# Altium schematic sheet HFXO.SchDoc: Chronos
size A4; CompanyName: RF Ranging Inc.; Engineer: Thomas Schmid; Revision: 4; SheetNumber: 7; SheetTotal: 10
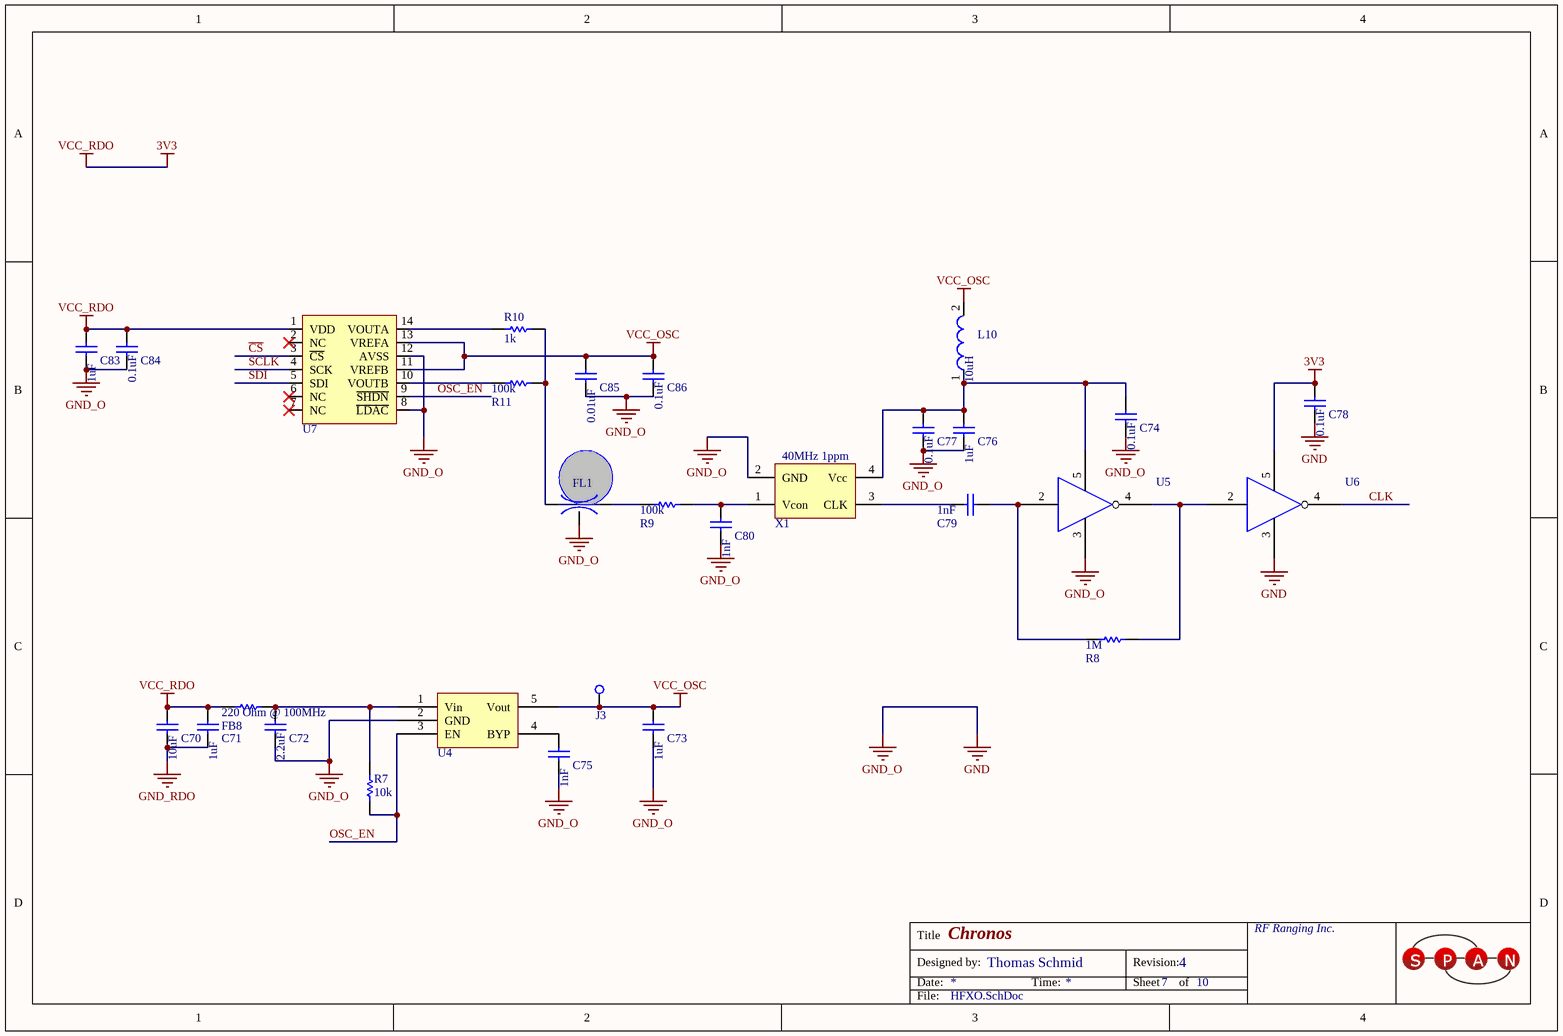
[diagram p0: HFXO.SchDoc]

## Parts
C70  GRM188C81C106MA73D  [CAPC1608X08N (0603)]  (value not drawn)
C71  GRM188R61A105KA61D  [CAPC1608X08N (0603)]  (value not drawn)
C72  GRM188R60J225KE19D  [CAPC1608X08N (0603)]  (value not drawn)
C73  GRM188R61A105KA61D  [CAPC1608X08N (0603)]  (value not drawn)
C74  GRM188R71C104KA01D  [CAPC1608X08N (0603)]  (value not drawn)
C75  GRM1885C1H102JA01D  [CAPC1608X08N (0603)]  (value not drawn)
C76  GRM188R61A105KA61D  [CAPC1608X08N (0603)]  (value not drawn)
C77  GRM188R71C104KA01D  [CAPC1608X08N (0603)]  (value not drawn)
C78  GRM188R71C104KA01D  [CAPC1608X08N (0603)]  (value not drawn)
C79  GRM1885C1H102JA01D  [CAPC1608X08N (0603)]  (value not drawn)
C80  GRM1885C1H102JA01D  [CAPC1608X08N (0603)]  (value not drawn)
C83  GRM188R61A105KA61D  [CAPC1608X08N (0603)]  (value not drawn)
C84  GRM188R71C104KA01D  [CAPC1608X08N (0603)]  (value not drawn)
C85  GRM188R71C103KA01D  [CAPC1608X08N (0603)]  (value not drawn)
C86  GRM188R71C104KA01D  [CAPC1608X08N (0603)]  (value not drawn)
FB8  BLM18BD221SN1D  [RESC1608X06N (0603)]  (value not drawn)
FL1  NFM21CC223R1H3D  [NFM21C]  (value not drawn)
J3  5004  [TP]  (value not drawn)
L10  LQM18FN100M00D  [INDC1608X08N]  (value not drawn)
R7  value 10k  [RESC1608X06N (0603)]  (hidden comment: MCR03ERTF1002)
R8  RC0603FR-071ML  [RESC1608X06N (0603)]  (value not drawn)
R9  RC0603FR-07100KL  [RESC1608X06N (0603)]  (value not drawn)
R10  value 1k  (hidden comment: CRCW06031K00FKEA)
R11  RC0603FR-07100KL  [RESC1608X06N (0603)]  (value not drawn)
U4  FAN2500S30X  [SOT95P280X145-5N]  (value not drawn)
U5  NC7SPU04P5X  [SC70]  (value not drawn)
U6  NC7SPU04P5X  [SC70]  (value not drawn)
U7  MCP4922-E/ST  [TSOP65P640X110-14N]  (value not drawn)
X1  ASVTX-12-A-40.000MHZ-H10-T  [2.5x2.0x0.9mmXTAL]  (value not drawn)

## Nets
3V3: C70.2 C71.2 C78.2 C83.2 C84.2 FB8.1 U6.5 U7.1(VDD)  [also labelled VCC_RDO]
GND: C72.1 C73.1 C74.1 C75.1 C76.1 C77.1 C78.1 C80.1 C83.1 C84.1 C85.1 C86.1 FL1.2 U4.2(GND) U5.3 U6.3 U7.8(~{LDAC}) U7.12(AVSS) X1.2(GND)  [also labelled GND_O]
GND_RDO: C70.1 C71.1
VCC_OSC: C73.2 C85.2 C86.2 J3.1 L10.2 U4.5(Vout) U7.11(VREFB) U7.13(VREFA)
~{CS}: U7.3(~{CS})
CLK: U6.4
OSC_EN: R7.1 U4.3(EN) U7.9(~{SHDN})
SCLK: U7.4(SCK)
SDI: U7.5(SDI)
NetC72_2: C72.2 FB8.2 R7.2 U4.1(Vin)
NetC74_2: C74.2 C76.2 C77.2 L10.1 U5.5 X1.4(Vcc)
NetC75_2: C75.2 U4.4(BYP)
NetC79_1: C79.1 X1.3(CLK)
NetC79_2: C79.2 R8.1 U5.2
NetC80_2: C80.2 R9.2 X1.1(Vcon)
NetFL1_1: FL1.1 R10.2 R11.2
NetFL1_3: FL1.3 R9.1
NetR8_2: R8.2 U5.4 U6.2
NetR10_1: R10.1 U7.14(VOUTA)
NetR11_1: R11.1 U7.10(VOUTB)

Not connected (* = marked no-connect by the designer): U5 1; U6 1; U7 2(NC)* 6(NC)* 7(NC)*

## Notes on the sheet
- Title
- Designed by:
- Date:
- Time:
- Revision:
- Sheet
- of
- File:
- (in symbol ASVTX-12-A-40.000MHZ-H10-T) 40MHz 1ppm
- (in symbol GRM188C81C106MA73D) 10uF
- (in symbol GRM188R60J225KE19D) 2.2uF
- (in symbol GRM188R61A105KA61D) 1uF
- (in symbol GRM188R71C103KA01D) 0.01uF
- (in symbol GRM188R71C104KA01D) 0.1uF
- (in symbol GRM1885C1H102JA01D) 1nF
- (in symbol LQM18FN100M00D) 10uH

## Library data of the parts
C70 = GRM188C81C106MA73D: CAP CER 10UF 16V 20% X6S 0603; Manufacturer: Murata Electronics North America; Capacitance: 10µF; Supplier 1: Digi-Key; Manufacturer Part Number: GRM188C81C106MA73D; RoHS: RoHS Compliant; Category: Capacitors; Stock 1: 59274; Pricing 1: 1=0.4, 10=0.349, 50=0.2118, 100=0.1744, 250=0.13952, 500=0.12708, 1000=0.11237 (USD); Packaging: Cut Tape (CT); Voltage - Rated: 16V; Tolerance: ±20%; Temperature Coefficient: X6S; Mounting Type: Surface Mount, MLCC; Operating Temperature: -55°C ~ 105°C; Applications: General Purpose; Ratings: -; Package / Case: 0603 (1608 Metric); Size / Dimension: 0.063" L x 0.031" W (1.60mm x 0.80mm); Height - Seated (Max): -; Thickness (Max): 0.031" (0.80mm); Lead Spacing: -; Features: -; Lead Style: -; ComponentLink1URL: http://www.murata.com/products/catalog/pdf/c02e.pdf; ComponentLink1Description: http://www.murata.com/products/catalog/pdf/c02e.pdf
C71 C73 C76 C83 = GRM188R61A105KA61D: CAP CER 1UF 10V 10% X5R 0603; Manufacturer: Murata Electronics North America; Capacitance: 1.0µF; Supplier 1: Digi-Key; Manufacturer Part Number: GRM188R61A105KA61D; RoHS: RoHS Compliant; Category: Capacitors; Stock 1: 244919; Pricing 1: 1=0.1, 10=0.041, 50=0.0224, 100=0.019, 250=0.01552, 500=0.01328, 1000=0.01035 (USD); Packaging: Cut Tape (CT); Voltage - Rated: 10V; Tolerance: ±10%; Temperature Coefficient: X5R; Mounting Type: Surface Mount, MLCC; Operating Temperature: -55°C ~ 85°C; Applications: General Purpose; Ratings: -; Package / Case: 0603 (1608 Metric); Size / Dimension: 0.063" L x 0.031" W (1.60mm x 0.80mm); Height - Seated (Max): -; Thickness (Max): 0.035" (0.90mm); Lead Spacing: -; Features: -; Lead Style: -; ComponentLink1URL: http://search.murata.co.jp/Ceramy/image/img/A01X/G101/ENG/GRM188R61A105KA61-01.pdf; ComponentLink1Description: http://search.murata.co.jp/Ceramy/image/img/A01X/G101/ENG/GRM188R61A105KA61-01.pdf
C72 = GRM188R60J225KE19D: CAP CER 2.2UF 6.3V 10% X5R 0603; Manufacturer: Murata Electronics North America; Capacitance: 2.2µF; Supplier 1: Digi-Key; Manufacturer Part Number: GRM188R60J225KE19D; RoHS: RoHS Compliant; Category: Capacitors; Stock 1: 155330; Pricing 1: 1=0.17, 10=0.114, 50=0.0658, 100=0.0543, 250=0.04572, 500=0.0383, 1000=0.03143 (USD); Packaging: Cut Tape (CT); Voltage - Rated: 6.3V; Tolerance: ±10%; Temperature Coefficient: X5R; Mounting Type: Surface Mount, MLCC; Operating Temperature: -55°C ~ 85°C; Applications: General Purpose; Ratings: -; Package / Case: 0603 (1608 Metric); Size / Dimension: 0.063" L x 0.031" W (1.60mm x 0.80mm); Height - Seated (Max): -; Thickness (Max): 0.035" (0.90mm); Lead Spacing: -; Features: -; Lead Style: -; ComponentLink1URL: http://search.murata.co.jp/Ceramy/image/img/A01X/G101/ENG/GRM188R60J225KE19-01.pdf; ComponentLink1Description: http://search.murata.co.jp/Ceramy/image/img/A01X/G101/ENG/GRM188R60J225KE19-01.pdf
C74 C77 C78 C84 C86 = GRM188R71C104KA01D: CAP CER 0.1UF 16V 10% X7R 0603; Manufacturer: Murata Electronics North America; Capacitance: 0.1µF; Supplier 1: Digi-Key; Manufacturer Part Number: GRM188R71C104KA01D; RoHS: RoHS Compliant; Category: Capacitors; Stock 1: 1458181; Pricing 1: 1=0.1, 10=0.019, 50=0.0102, 100=0.0086, 250=0.00704, 500=0.006, 1000=0.00468 (USD); Packaging: Cut Tape (CT); Tolerance: ±10%; Voltage - Rated: 16V; Temperature Coefficient: X7R; Mounting Type: Surface Mount, MLCC; Operating Temperature: -55°C ~ 125°C; Applications: General Purpose; Ratings: -; Package / Case: 0603 (1608 Metric); Size / Dimension: 0.063" L x 0.031" W (1.60mm x 0.80mm); Height - Seated (Max): -; Thickness (Max): 0.035" (0.90mm); Lead Spacing: -; Features: -; Lead Style: -; ComponentLink1URL: http://search.murata.co.jp/Ceramy/image/img/A01X/G101/ENG/GRM188R71C104KA01-01.pdf; ComponentLink1Description: http://search.murata.co.jp/Ceramy/image/img/A01X/G101/ENG/GRM188R71C104KA01-01.pdf
C75 C79 C80 = GRM1885C1H102JA01D: CAP CER 1000PF 50V 5% NP0 0603; Manufacturer: Murata Electronics North America; Temperature Coefficient: C0G, NP0; Supplier 1: Digi-Key; Manufacturer Part Number: GRM1885C1H102JA01D; RoHS: RoHS Compliant; Category: Capacitors; Stock 1: 140000; Pricing 1: 4000=0.00863, 8000=0.00788, 12000=0.0075, 28000=0.00713, 100000=0.00516 (USD); Packaging: Tape & Reel (TR); Capacitance: 1000pF; Voltage - Rated: 50V; Tolerance: ±5%; Mounting Type: Surface Mount, MLCC; Operating Temperature: -55°C ~ 125°C; Applications: General Purpose; Ratings: -; Package / Case: 0603 (1608 Metric); Size / Dimension: 0.063" L x 0.031" W (1.60mm x 0.80mm); Height - Seated (Max): -; Thickness (Max): 0.035" (0.90mm); Lead Spacing: -; Features: -; Lead Style: -; ComponentLink1URL: http://www.murata.com/products/catalog/pdf/c02e.pdf; ComponentLink1Description: http://www.murata.com/products/catalog/pdf/c02e.pdf
C85 = GRM188R71C103KA01D: CAP CER 10000PF 16V 10% X7R 0603; Manufacturer: Murata Electronics North America; Supplier 1: Digi-Key; Manufacturer Part Number: GRM188R71C103KA01D; RoHS: RoHS Compliant; Category: Capacitors; Stock 1: 0; Pricing 1: 1=0 (USD); Packaging: Cut Tape (CT); Capacitance: 10000pF; Voltage - Rated: 16V; Tolerance: ±10%; Temperature Coefficient: X7R; Mounting Type: Surface Mount, MLCC; Operating Temperature: -55°C ~ 125°C; Applications: General Purpose; Ratings: -; Package / Case: 0603 (1608 Metric); Size / Dimension: 0.063" L x 0.031" W (1.60mm x 0.80mm); Height - Seated (Max): -; Thickness (Max): 0.035" (0.90mm); Lead Spacing: -; Features: -; Lead Style: -; ComponentLink1URL: http://search.murata.co.jp/Ceramy/image/img/A01X/G101/ENG/GRM188R71C103KA01-01.pdf; ComponentLink1Description: http://search.murata.co.jp/Ceramy/image/img/A01X/G101/ENG/GRM188R71C103KA01-01.pdf
FB8 = BLM18BD221SN1D: FERRITE CHIP 220 OHM 200MA 0603; Manufacturer: Murata Electronics North America; Impedance @ Frequency: 220 Ohm @ 100MHz; DC Resistance (DCR): 450 mOhm Max; Filter Type: Differential Mode - Single; Supplier 1: Digi-Key; Manufacturer Part Number: BLM18BD221SN1D; RoHS: RoHS Compliant; Category: Filters; Stock 1: 35645; Pricing 1: 1=0.1, 10=0.087, 50=0.0712, 100=0.0523, 250=0.038, 500=0.03484, 1000=0.0301 (USD); Packaging: Cut Tape (CT); Current Rating: 200mA; Package / Case: 0603 (1608 Metric); Mounting Type: Surface Mount; Height (Max): 0.037" (0.95mm); Size / Dimension: 0.063" L x 0.031" W (1.60mm x 0.80mm); ComponentLink1URL: http://search.murata.co.jp/Ceramy/image/img/PDF/ENG/L0110S0100BLM18B.pdf; ComponentLink1Description: http://search.murata.co.jp/Ceramy/image/img/PDF/ENG/L0110S0100BLM18B.pdf
FL1 = NFM21CC223R1H3D: FILTER LC HIGH FREQ 22000PF 0805; Manufacturer: Murata Electronics North America; Capacitance: 0.022µF; Voltage: 50V; Current: 2A; DC Resistance (DCR): 30 mOhm Max; Supplier 1: Digi-Key; Manufacturer Part Number: NFM21CC223R1H3D; RoHS: RoHS Compliant; Category: Filters; Stock 1: 4000; Pricing 1: 4000=0.12353, 8000=0.11438 (USD); Packaging: Tape & Reel (TR); Operating Temperature: -55°C ~ 125°C; Package / Case: 0805 (2012 Metric), 3 PC Pad; Height (Max): 0.037" (0.95mm); Size / Dimension: 0.079" L x 0.049" W (2.00mm x 1.25mm); Thread Size: -; ComponentLink1URL: http://search.murata.co.jp/Ceramy/image/img/PDF/ENG/L0111S0109NFM21C.pdf; ComponentLink1Description: http://search.murata.co.jp/Ceramy/image/img/PDF/ENG/L0111S0109NFM21C.pdf
J3 = 5004: TEST POINT PC MINI .040"D YELLOW; Manufacturer: Keystone Electronics; Supplier 1: Digi-Key; Manufacturer Part Number: 5004; RoHS: RoHS Compliant; Category: Test and Measurement; Stock 1: 45761; Pricing 1: 1=0.34, 10=0.318, 50=0.232, 100=0.2228, 250=0.20008, 500=0.191, 1000=0.15916, 2500=0.14552, 5000=0.13643 (USD); Packaging: Bulk; Type: PC Test Point, Miniature; Terminal: 0.010" x 0.020" (0.25mm x 0.51mm) Phosphor Bronze Wire, Silver Plated; Mounting Type: 0.040" (1.02mm) Hole Diameter; Material: Base, Nylon 46, UL 94V-0; Color: Yellow; ComponentLink1URL: http://www.keyelco.com/product-pdf.cfm?p=1313; ComponentLink1Description: http://www.keyelco.com/product-pdf.cfm?p=1313
L10 = LQM18FN100M00D: INDUCTOR 10UH 50MA 0603; Manufacturer: Murata Electronics North America; Type: Multilayer; Inductance: 10µH; Tolerance: ±20%; Shielding: Shielded; DC Resistance (DCR): 900 mOhm; Frequency - Self Resonant: 30MHz; Frequency - Test: 1MHz; Supplier 1: Digi-Key; Manufacturer Part Number: LQM18FN100M00D; RoHS: RoHS Compliant; Category: Inductors, Coils, Chokes; Stock 1: 28547; Pricing 1: 1=0.14, 10=0.13, 25=0.1164, 50=0.101, 100=0.0907, 250=0.08416, 500=0.0777, 750=0.07381, 1000=0.06734 (USD); Packaging: Cut Tape (CT); Material - Core: -; Current Rating: 50mA; Current - Saturation: -; Q @ Freq: -; Operating Temperature: -55°C ~ 125°C; Mounting Type: Surface Mount; Package / Case: 0603 (1608 Metric); Size / Dimension: 0.063" L x 0.031" W (1.60mm x 0.80mm); Height - Seated (Max): 0.035" (0.90mm); Supplier Device Package: 0603 (1608 Metric); ComponentLink1URL: http://search.murata.co.jp/Ceramy/image/img/PDF/ENG/L0075S0097LQM18F.pdf; ComponentLink1Description: http://search.murata.co.jp/Ceramy/image/img/PDF/ENG/L0075S0097LQM18F.pdf
R7 = MCR03ERTF1002: RES SMD 10K OHM 1% 1/10W 0603; Manufacturer: Rohm Semiconductor; Power (Watts): 0.1W, 1/10W; Temperature Coefficient: ±100ppm/°C; Supplier 1: Digi-Key; Manufacturer Part Number: MCR03ERTF1002; RoHS: RoHS Compliant; Category: Resistors; Stock 1: 30590; Pricing 1: 1=0.1, 10=0.022, 25=0.016, 100=0.0089, 250=0.0068, 500=0.00542, 1000=0.00399 (USD); Packaging: Digi-Reel®; Resistance (Ohms): 10k; Tolerance: ±1%; Composition: Thick Film; Features: -; Package / Case: 0603 (1608 Metric); Supplier Device Package: 0603 (1608 Metric); Size / Dimension: 0.063" L x 0.031" W (1.60mm x 0.80mm); Height: 0.022" (0.55mm); Number of Terminations: 2; ComponentLink1URL: http://rohmfs.rohm.com/en/products/databook/datasheet/passive/resistor/chip_resistor/mcr_g.pdf; ComponentLink1Description: http://rohmfs.rohm.com/en/products/databook/datasheet/passive/resistor/chip_resistor/mcr_g.pdf; Operating Temperature: -55°C ~ 155°C; Supplier Part Number 1: RHM10.0KCFDKR-ND
R8 = RC0603FR-071ML: RES 1.00M OHM 1/10W 1% 0603 SMD; Manufacturer: Yageo; Resistance (Ohms): 1M; Power (Watts): 0.1W, 1/10W; Temperature Coefficient: ±100ppm/°C; Supplier 1: Digi-Key; Manufacturer Part Number: RC0603FR-071ML; RoHS: RoHS Compliant; Category: Resistors; Stock 1: 1280000; Pricing 1: 5000=0.00171, 10000=0.00149, 25000=0.00131, 50000=0.0012, 125000=0.00117 (USD); Packaging: Tape & Reel (TR); Tolerance: ±1%; Composition: Thick Film; Features: -; Package / Case: 0603 (1608 Metric); Supplier Device Package: 0603; Size / Dimension: 0.063" L x 0.031" W (1.60mm x 0.80mm); Height: 0.022" (0.55mm); Number of Terminations: 2; ComponentLink1URL: http://www.yageo.com/documents/recent/PYu-RC0603_51_RoHS_L_4.pdf; ComponentLink1Description: http://www.yageo.com/documents/recent/PYu-RC0603_51_RoHS_L_4.pdf
R9 R11 = RC0603FR-07100KL: RES 100K OHM 1/10W 1% 0603 SMD; Manufacturer: Yageo; Power (Watts): 0.1W, 1/10W; Temperature Coefficient: ±100ppm/°C; Supplier 1: Digi-Key; Manufacturer Part Number: RC0603FR-07100KL; RoHS: RoHS Compliant; Category: Resistors; Stock 1: 2865000; Pricing 1: 5000=0.00171, 10000=0.00149, 25000=0.00131, 50000=0.0012, 125000=0.00117 (USD); Packaging: Tape & Reel (TR); Resistance (Ohms): 100k; Tolerance: ±1%; Composition: Thick Film; Features: -; Package / Case: 0603 (1608 Metric); Supplier Device Package: 0603; Size / Dimension: 0.063" L x 0.031" W (1.60mm x 0.80mm); Height: 0.022" (0.55mm); Number of Terminations: 2; ComponentLink1URL: http://www.yageo.com/documents/recent/PYu-RC0603_51_RoHS_L_4.pdf; ComponentLink1Description: http://www.yageo.com/documents/recent/PYu-RC0603_51_RoHS_L_4.pdf
R10 = CRCW06031K00FKEA: RES SMD 1K OHM 1% 1/10W 0603; Manufacturer: Vishay Dale; Power (Watts): 0.1W, 1/10W; Temperature Coefficient: ±100ppm/°C; Supplier 1: Digi-Key; Manufacturer Part Number: CRCW06031K00FKEA; RoHS: RoHS Compliant; Category: Resistors; Stock 1: 1035099; Pricing 1: 10=0.081, 50=0.0436, 200=0.0251, 1000=0.01711 (USD); Packaging: Digi-Reel®; Resistance (Ohms): 1k; Tolerance: ±1%; Composition: Thick Film; Features: Automotive AEC-Q200; Package / Case: 0603 (1608 Metric); Supplier Device Package: 0603 (1608 Metric); Size / Dimension: 0.061" L x 0.033" W (1.55mm x 0.85mm); Height: 0.020" (0.50mm); Number of Terminations: 2; ComponentLink1URL: http://www.vishay.com/docs/20035/dcrcwe3.pdf; ComponentLink1Description: http://www.vishay.com/docs/20035/dcrcwe3.pdf; Operating Temperature: -55°C ~ 155°C; Supplier Part Number 1: 541-1.00KHDKR-ND
U4 = FAN2500S30X: IC REG LDO 3V 0.1A SOT23-5; Manufacturer: Fairchild Semiconductor; Regulator Topology: Positive Fixed; Current - Output: 100mA; Voltage - Dropout (Typical): 0.1V @ 100mA; Number of Regulators: 1; Voltage - Input: Up to 6.5V; Supplier 1: Digi-Key; Manufacturer Part Number: FAN2500S30X; RoHS: RoHS Compliant; Category: Integrated Circuits (ICs); Stock 1: 6000; Pricing 1: 3000=0.25462, 6000=0.23706, 15000=0.22828, 30000=0.2195, 75000=0.21599, 150000=0.21072 (USD); Packaging: Tape & Reel (TR); Voltage - Output: 3V; Current - Limit (Min): -; Operating Temperature: -40°C ~ 125°C; Mounting Type: Surface Mount; Package / Case: SC-74A, SOT-753; Supplier Device Package: SOT-23-5; ComponentLink1URL: http://www.fairchildsemi.com/ds/FA/FAN2500.pdf; ComponentLink1Description: http://www.fairchildsemi.com/ds/FA/FAN2500.pdf
U5 U6 = NC7SPU04P5X: IC INVERTER ULP UNBUFF SC70-5; Manufacturer: Fairchild Semiconductor; Number of Circuits: 1; Voltage - Supply: 0.9 V ~ 3.6 V; Current - Quiescent (Max): 0.9µA; Current - Output High, Low: 2.6mA, 2.6mA; Max Propagation Delay @ V, Max CL: 9.2ns @ 3.3V, 30pF; Supplier 1: Digi-Key; Manufacturer Part Number: NC7SPU04P5X; RoHS: RoHS Compliant; Category: Integrated Circuits (ICs); Stock 1: 24000; Pricing 1: 3000=0.0798, 6000=0.07182, 15000=0.06384, 30000=0.05985, 75000=0.05307, 150000=0.05107 (USD); Packaging: Tape & Reel (TR); Logic Type: Inverter; Number of Inputs: 1; Features: -; Logic Level - Low: -; Logic Level - High: -; Operating Temperature: -40°C ~ 85°C; Mounting Type: Surface Mount; Supplier Device Package: SC-70-5; Package / Case: 6-TSSOP (5 Lead), SC-88A, SOT-353; ComponentLink1URL: http://www.fairchildsemi.com/ds/NC/NC7SPU04.pdf; ComponentLink1Description: http://www.fairchildsemi.com/ds/NC/NC7SPU04.pdf
U7 = MCP4922-E/ST: IC DAC 12BIT DUAL W/SPI 14TSSOP; Manufacturer: Microchip Technology; Settling Time: 4.5µs; Number of Bits: 12; Data Interface: Serial, SPI™; Number of Converters: 2; Voltage Supply Source: Single Supply; Number of Outputs and Type: 2 Voltage, Unipolar; 2 Voltage, Bipolar; Supplier 1: Digi-Key; Manufacturer Part Number: MCP4922-E/ST; RoHS: RoHS Compliant; Category: Integrated Circuits (ICs); Stock 1: 461; Pricing 1: 1=3.14, 10=2.62, 25=2.19, 100=1.99 (USD); Packaging: Tube; Operating Temperature: -40°C ~ 125°C; Mounting Type: Surface Mount; Package / Case: 14-TSSOP (0.173", 4.40mm Width); Supplier Device Package: 14-TSSOP; Sampling Rate (Per Second): *; ComponentLink1URL: http://www.microchip.com/mymicrochip/filehandler.aspx?ddocname=en547858; ComponentLink1Description: http://www.microchip.com/mymicrochip/filehandler.aspx?ddocname=en547858
X1 = ASVTX-12-A-40.000MHZ-H10-T: OSC VCTCXO 40.000MHZ SNWV SMD; Manufacturer: Abracon Corporation; Frequency: 40MHz; Output: Clipped Sine Wave; Voltage - Supply: 3V; Frequency Stability: ±1ppm; Current - Supply (Max): 2.5mA; Supplier 1: Digi-Key; Manufacturer Part Number: ASVTX-12-A-40.000MHZ-H10-T; RoHS: RoHS Compliant; Category: Crystals and Oscillators; Stock 1: 0; Pricing 1: 1000=2.17, 3000=2.015, 5000=1.9375 (USD); Packaging: Tape & Reel (TR); Type: VCTCXO; Function: -; Operating Temperature: -30°C ~ 85°C; Ratings: -; Mounting Type: Surface Mount; Size / Dimension: 0.098" L x 0.079" W (2.50mm x 2.00mm); Height: 0.035" (0.90mm); Package / Case: 4-SMD, No Lead (DFN, LCC); Current - Supply (Disable) (Max): -; ComponentLink1URL: http://www.abracon.com/Oscillators/ASTX12_ASVTX12.pdf; ComponentLink1Description: http://www.abracon.com/Oscillators/ASTX12_ASVTX12.pdf